# Altium project iiot_chip.PrjPcb
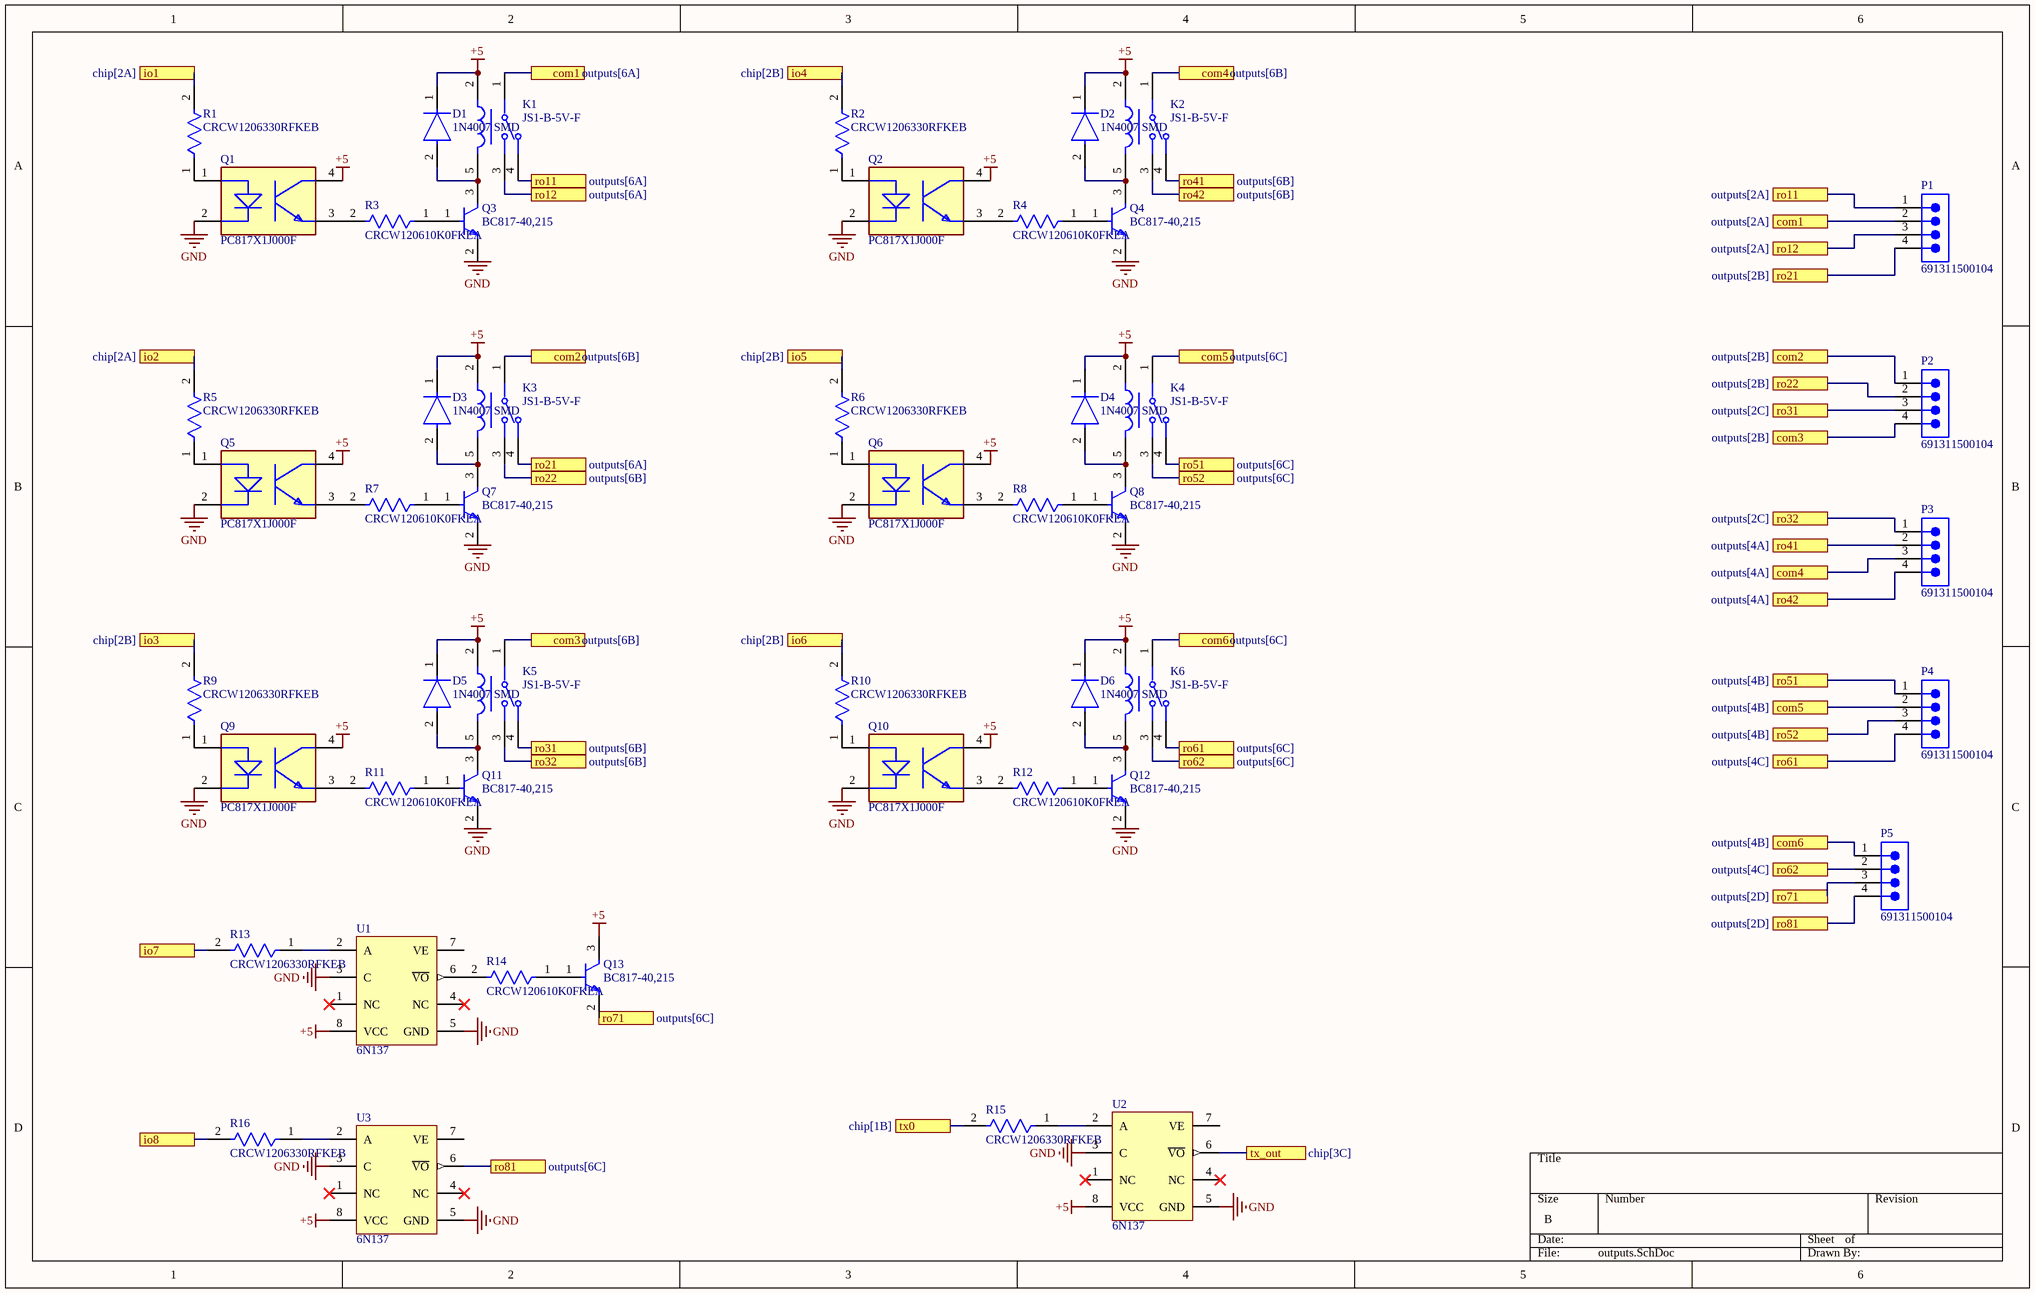
[diagram p0: outputs.SchDoc]
3 sheets, 95 parts. Net scope: flat (ports and power ports of the same name join across sheets).
Board file: iiot_with_chip.PcbDoc
Sheets:
  outputs.SchDoc
  inputs.SchDoc
  chip.SchDoc

## Sheet outputs.SchDoc
size B; SheetNumber: 1; SheetTotal: 3

### Parts
D1  1N4007 SMD  [FP-1N4007_SMD-IPC_C]
D2  1N4007 SMD  [FP-1N4007_SMD-IPC_C]
D3  1N4007 SMD  [FP-1N4007_SMD-IPC_C]
D4  1N4007 SMD  [FP-1N4007_SMD-IPC_C]
D5  1N4007 SMD  [FP-1N4007_SMD-IPC_C]
D6  1N4007 SMD  [FP-1N4007_SMD-IPC_C]
K1  JS1-B-5V-F  [FP-JS1-B-5V-F-MFG]
K2  JS1-B-5V-F  [FP-JS1-B-5V-F-MFG]
K3  JS1-B-5V-F  [FP-JS1-B-5V-F-MFG]
K4  JS1-B-5V-F  [FP-JS1-B-5V-F-MFG]
K5  JS1-B-5V-F  [FP-JS1-B-5V-F-MFG]
K6  JS1-B-5V-F  [FP-JS1-B-5V-F-MFG]
P1  691311500104  [691311500104]
P2  691311500104  [691311500104]
P3  691311500104  [691311500104]
P4  691311500104  [691311500104]
P5  691311500104  [691311500104]
Q1  PC817X1J000F  [FP-PC817X1J000F-MFG]
Q2  PC817X1J000F  [FP-PC817X1J000F-MFG]
Q3  BC817-40,215  [FP-SOT23-MFG]
Q4  BC817-40,215  [FP-SOT23-MFG]
Q5  PC817X1J000F  [FP-PC817X1J000F-MFG]
Q6  PC817X1J000F  [FP-PC817X1J000F-MFG]
Q7  BC817-40,215  [FP-SOT23-MFG]
Q8  BC817-40,215  [FP-SOT23-MFG]
Q9  PC817X1J000F  [FP-PC817X1J000F-MFG]
Q10  PC817X1J000F  [FP-PC817X1J000F-MFG]
Q11  BC817-40,215  [FP-SOT23-MFG]
Q12  BC817-40,215  [FP-SOT23-MFG]
Q13  BC817-40,215  [FP-SOT23-MFG]
R1  CRCW1206330RFKEB  [FP-CRCW1206-e3-IPC_A]
R2  CRCW1206330RFKEB  [FP-CRCW1206-e3-IPC_A]
R3  CRCW120610K0FKEA  [FP-CRCW1206-e3-IPC_C]
R4  CRCW120610K0FKEA  [FP-CRCW1206-e3-IPC_C]
R5  CRCW1206330RFKEB  [FP-CRCW1206-e3-IPC_A]
R6  CRCW1206330RFKEB  [FP-CRCW1206-e3-IPC_A]
R7  CRCW120610K0FKEA  [FP-CRCW1206-e3-IPC_C]
R8  CRCW120610K0FKEA  [FP-CRCW1206-e3-IPC_C]
R9  CRCW1206330RFKEB  [FP-CRCW1206-e3-IPC_A]
R10  CRCW1206330RFKEB  [FP-CRCW1206-e3-IPC_A]
R11  CRCW120610K0FKEA  [FP-CRCW1206-e3-IPC_C]
R12  CRCW120610K0FKEA  [FP-CRCW1206-e3-IPC_C]
R13  CRCW1206330RFKEB  [FP-CRCW1206-e3-IPC_A]
R14  CRCW120610K0FKEA  [FP-CRCW1206-e3-IPC_C]
R15  CRCW1206330RFKEB  [FP-CRCW1206-e3-IPC_A]
R16  CRCW1206330RFKEB  [FP-CRCW1206-e3-IPC_A]
U1  6N137  [VISH-DIP-8_A]
U2  6N137  [VISH-DIP-8_A]
U3  6N137  [VISH-DIP-8_A]

### Ports
com1 (see outputs[2A]), com1 (see outputs[6A]), com2 (see outputs[2B]), com2 (see outputs[6B]), com3 (see outputs[2B]), com3 (see outputs[6B]), com4 (see outputs[4A]), com4 (see outputs[6B]), com5 (see outputs[4B]), com5 (see outputs[6C]), com6 (see outputs[4B]), com6 (see outputs[6C]), io1 (see chip[2A]), io2 (see chip[2A]), io3 (see chip[2B]), io4 (see chip[2B]), io5 (see chip[2B]), io6 (see chip[2B]), io7, io8, ro11 (see outputs[2A]), ro11 (see outputs[6A]), ro12 (see outputs[2A]), ro12 (see outputs[6A]), ro21 (see outputs[2B]), ro21 (see outputs[6A]), ro22 (see outputs[2B]), ro22 (see outputs[6B]), ro31 (see outputs[2C]), ro31 (see outputs[6B]), ro32 (see outputs[2C]), ro32 (see outputs[6B]), ro41 (see outputs[4A]), ro41 (see outputs[6B]), ro42 (see outputs[4A]), ro42 (see outputs[6B]), ro51 (see outputs[4B]), ro51 (see outputs[6C]), ro52 (see outputs[4B]), ro52 (see outputs[6C]), ro61 (see outputs[4C]), ro61 (see outputs[6C]), ro62 (see outputs[4C]), ro62 (see outputs[6C]), ro71 (see outputs[2D]), ro71 (see outputs[6C]), ro81 (see outputs[2D]), ro81 (see outputs[6C]), tx0 (see chip[1B]), tx_out (see chip[3C])

### Nets
+5: D1.1(C) D2.1(C) D3.1(C) D4.1(C) D5.1(C) D6.1(C) K1.2 K2.2 K3.2 K4.2 K5.2 K6.2 Q1.4(C) Q2.4(C) Q5.4(C) Q6.4(C) Q9.4(C) Q10.4(C) Q13.3(C) U1.8(VCC) U2.8(VCC) U3.8(VCC)
GND: Q1.2(C) Q2.2(C) Q3.2(E) Q4.2(E) Q5.2(C) Q6.2(C) Q7.2(E) Q8.2(E) Q9.2(C) Q10.2(C) Q11.2(E) Q12.2(E) U1.3(C) U1.5(GND) U2.3(C) U2.5(GND) U3.3(C) U3.5(GND)
NetD1_2: D1.2(A) K1.5 Q3.3(C)
NetD2_2: D2.2(A) K2.5 Q4.3(C)
NetD3_2: D3.2(A) K3.5 Q7.3(C)
NetD4_2: D4.2(A) K4.5 Q8.3(C)
NetD5_2: D5.2(A) K5.5 Q11.3(C)
NetD6_2: D6.2(A) K6.5 Q12.3(C)
NetK1_1: K1.1(COM) P1.2 ; port com1
NetK1_3: K1.3(NO) P1.3 ; port ro12
NetK1_4: K1.4(NC) P1.1 ; port ro11
NetK2_1: K2.1(COM) P3.3 ; port com4
NetK2_3: K2.3(NO) P3.4 ; port ro42
NetK2_4: K2.4(NC) P3.2 ; port ro41
NetK3_1: K3.1(COM) P2.1 ; port com2
NetK3_3: K3.3(NO) P2.2 ; port ro22
NetK3_4: K3.4(NC) P1.4 ; port ro21
NetK4_1: K4.1(COM) P4.2 ; port com5
NetK4_3: K4.3(NO) P4.3 ; port ro52
NetK4_4: K4.4(NC) P4.1 ; port ro51
NetK5_1: K5.1(COM) P2.4 ; port com3
NetK5_3: K5.3(NO) P3.1 ; port ro32
NetK5_4: K5.4(NC) P2.3 ; port ro31
NetK6_1: K6.1(COM) P5.1 ; port com6
NetK6_3: K6.3(NO) P5.2 ; port ro62
NetK6_4: K6.4(NC) P4.4 ; port ro61
NetMD1_26: R1.2 ; port io1
NetMD1_27: R9.2 ; port io3
NetMD1_28: R2.2 ; port io4
NetMD1_29: R5.2 ; port io2
NetMD1_30: R6.2 ; port io5
NetMD1_31: R10.2 ; port io6
NetMD1_35: R15.2 ; port tx0
NetP5_3: P5.3 Q13.2(E) ; port ro71
NetP5_4: P5.4 U3.6(~{VO}) ; port ro81
NetP8_3: U2.6(~{VO}) ; port tx_out
NetQ1_1: Q1.1(A) R1.1
NetQ1_3: Q1.3(E) R3.2
NetQ2_1: Q2.1(A) R2.1
NetQ2_3: Q2.3(E) R4.2
NetQ3_1: Q3.1(B) R3.1
NetQ4_1: Q4.1(B) R4.1
NetQ5_1: Q5.1(A) R5.1
NetQ5_3: Q5.3(E) R7.2
NetQ6_1: Q6.1(A) R6.1
NetQ6_3: Q6.3(E) R8.2
NetQ7_1: Q7.1(B) R7.1
NetQ8_1: Q8.1(B) R8.1
NetQ9_1: Q9.1(A) R9.1
NetQ9_3: Q9.3(E) R11.2
NetQ10_1: Q10.1(A) R10.1
NetQ10_3: Q10.3(E) R12.2
NetQ11_1: Q11.1(B) R11.1
NetQ12_1: Q12.1(B) R12.1
NetQ13_1: Q13.1(B) R14.1
NetR13_1: R13.1 U1.2(A)
NetR13_2: R13.2 ; port io7
NetR14_2: R14.2 U1.6(~{VO})
NetR15_1: R15.1 U2.2(A)
NetR16_1: R16.1 U3.2(A)
NetR16_2: R16.2 ; port io8

Not connected (* = marked no-connect by the designer): U1 1(NC)* 4(NC)* 7(VE); U2 1(NC)* 4(NC)* 7(VE); U3 1(NC)* 4(NC)* 7(VE)

### Library data of the parts
D1-D6 = CMP-12389-000001-1: Rectifier, 1Kv, 1A, Do-214Ac Rohs Compliant: Yes
K1-K6 = CMP-00287-00689748-1: JS1-B-5V-F Electromechanical Relay 5VDC 69.4Ohm 5ADC/10AAC SPDT (22x16x16.4)mm THT Power Relay; NexarPartId: 689748; Coil Voltage (DC): 5V; Coil Resistance: 69.4Ω; Coil Power: 360mW; Voltage Rating (AC): 250V; Number of Contacts: 1; Coil Type: Non-Latching; Current Rating: 10A; Coil Current: 72mA; Operate Time: 10ms; Max Voltage Rating (DC): 100V; Relay Type: General Purpose; Throw Configuration: SPDT; Depth: 16mm; Lead Free: Lead Free; Contact Material: Silver, Tin; Max Operating Temperature: 85°C; Number of Pins: 5; Mount: Through Hole; Ambient Temperature Range High: 85°C; Height: 16mm; Weight: 12g; Power Consumption: 360mW; REACH SVHC: No SVHC; Min Operating Temperature: -40°C; Termination: PC Pin; Width: 22mm; Max Current Rating: 10A; Packaging: Bulk; Length: 22mm; Switching Current: 10A; Power Rating: 360mW; RoHS: Compliant; Max Voltage Rating (AC): 250V; Release Time: 10ms; Contact Current Rating: 10A
P1-P5 = CMP-1502-02148-2: NexarPartId: 8917749; Pitch: 5.08mm; Number of Positions Per Level: 4; Gender: Male; Voltage: 300V; Current: 20A; Number of Levels: 1; Orientation: Vertical; Number of Pins: 4; Mount: Through Hole; Number of Contacts: 4; Length: 8.5mm; Number of Rows: 1; Contact Plating: Tin; Color: Green; Termination: Solder; Contact Material: Brass; REACH SVHC: Unknown; RoHS: Compliant; Lead Pitch: 5.08mm; Width: 22.32mm; Height: 12mm; Packaging: Box
Q1 Q2 Q5 Q6 Q9 Q10 = CMP-65434-000003-1: OPTOISOLATOR 5KV TRANS 4DIP; Collector Emitter Saturation Voltage: 200mV; Forward Voltage: 1.4V; Power Dissipation: 200mW; Input Current: 20mA; Max Collector Current: 50mA; Collector Emitter Breakdown Voltage: 80V; Rise Time: 18000ns; Number of Elements: 1; Reverse Breakdown Voltage: 6V; Current Transfer Ratio: 600%; Min Operating Temperature: -30°C; Number of Pins: 4; Radiation Hardening: No; Output Current per Channel: 50mA; Case/Package: DIP; Fall Time: 18000ns; Forward Current: 50mA; Isolation Voltage: 5kV; Package Quantity: 2000; Max Operating Temperature: 100°C; Packaging: Sleeve; Max Input Current: 50mA; Output Voltage: 80V; Max Power Dissipation: 200mW; Mount: Through Hole; Number of Channels: 1; Collector Emitter Voltage (VCEO): 80V
Q3 Q4 Q7 Q8 Q11-Q13 = CMP-14406-000007-1: TRANS NPN 45V 0.5A SOT23; Manufacturer: Nexperia; Collector Emitter Saturation Voltage: 700mV; Power Dissipation: 250mW; Collector Base Voltage: 50V; Unity Gain Freq: 100MHz; Hfe Max: 600; Rthja Max: 500K/W; Emitter Base Voltage: 5V; Max Collector Current: 500mA; Hfe Testvce: 1V; Automotive Grade: Grade 0; Hfe Min: 250; Max Junction Temp: +150°C; Number Of Npn: 1; Hfe Testic: 100mA; Octopart: https://octopart.com/bc817-40%2C215-nexperia-78739081; Lead Free: Yes; Ipc Land Pattern Name: SOT95P230X100-3; Manufacturer Part Number: BC817-40,215; RoHS: TRUE; Collector Emitter Breakdown Voltage: 45V; Digikey Description: TRANS NPN 45V 0.5A SOT23; ComponentLink2URL: https://assets.nexperia.com/documents/data-sheet/BC817_SER.pdf; Temperature Range High: +150°C; Mouser Description: BC817 Series 45 V 500 mA 250 mW SMT NPN General-Purpose Transistor - SOT-23-; Device Class L3: BJTs; Temperature: to +150°C; Height: 1.1mm; Automotive: Yes; Ambient Temperature Range Low: -65°C; Package: SOT23; Collector Emitter Voltage: 45V; Category: Trans; ComponentLink2Description: Datasheet; Device Class L2: Transistors; Ambient Temperature Range High: +150°C; Number Of Elements: 1; Device Class L1: Discrete Semiconductors; Footprint Url: https://assets.nexperia.com/documents/outline-drawing/SOT23.pdf
R1 R2 R5 R6 R9 R10 R13 R15 R16 = CMP-02407-010853-1: RES Thick Film, 330Ω, 1%, 0.25W, 100ppm/°C, 1206; Resistance: 330R; Power Rating: 250mW; Voltage Rating: 200V; Package Quantity: 10000; Width: 0.063inch; Length: 0.126inch; Case/Package: 1206; Lead Free: Lead Free; Max Operating Temperature: 155°C; Height: 0.024inch; Case Code (Imperial): 1206; Weight: 0.000353oz; Max Power Dissipation: 250mW; Packaging: Tape and Reel; Case Code (Metric): 3216; Number of Terminations: 2; Min Operating Temperature: -55°C; Features: Automotive AEC-Q200; Tolerance: 1%; Composition: Thick Film; Temperature Coefficient: 100ppm/°C
R3 R4 R7 R8 R11 R12 R14 = CMP-2003-04807-2: RES Thick Film, 10kΩ, 1%, 0.25W, 100ppm/°C, 1206; Working Voltage: 200V; Max Power Dissipation: 250mW; Resistance: 10kR; Tolerance: 1%; Width: 0.063inch; Height: 0.55mm; Number of Pins: 2; Voltage Rating: 200V; Temperature Coefficient: 100ppm/°C; Military Standard: Not; Features: Automotive AEC-Q200; Depth: 1.6mm; Radiation Hardening: No; Termination: SMD/SMT; Case Code (Imperial): 1206; Weight: 0.000353oz; Length: 3.2mm; Package Quantity: 10; Voltage Rating (DC): 200V; Case/Package: 1206; Min Operating Temperature: -55°C; Number of Terminations: 2; Composition: Thick Film; Contact Plating: Tin; Power Rating: 250mW; Packaging: Tape and Reel; Max Operating Temperature: 155°C; Lead Free: Lead Free; Case Code (Metric): 3216
U1-U3 = CMP-2000-05669-1: High Speed Optocoupler, Single and Dual, 10 MBd, 5 V, -40 to 100 degC, 8-Pin DIP, RoHS, Tube; Manufacturer: Vishay; No. of Channels: 1Channel; Isolation Voltage: 5.3kV; Data Rate: 10Mbaud; SVHC: ToBeAdvised; No. of Pins: 8Pins; Package Description: 8-Pin Double In-line Package, Body 10.16 x 6.7 mm, Pitch 2.54 mm; Manufacturer URL: http://www.vishay.com/; Product Range: -; Optocoupler Case Style: DIP; Mounting Technology: ThroughHole; Packaging: Each; Package Reference: DIP-8; Datasheet Version: Rev. 1.9, 03/2015; Datasheet URL: http://www.vishay.com/docs/84732/6n137.pdf

## Sheet inputs.SchDoc
size B; SheetNumber: 2; SheetTotal: 3
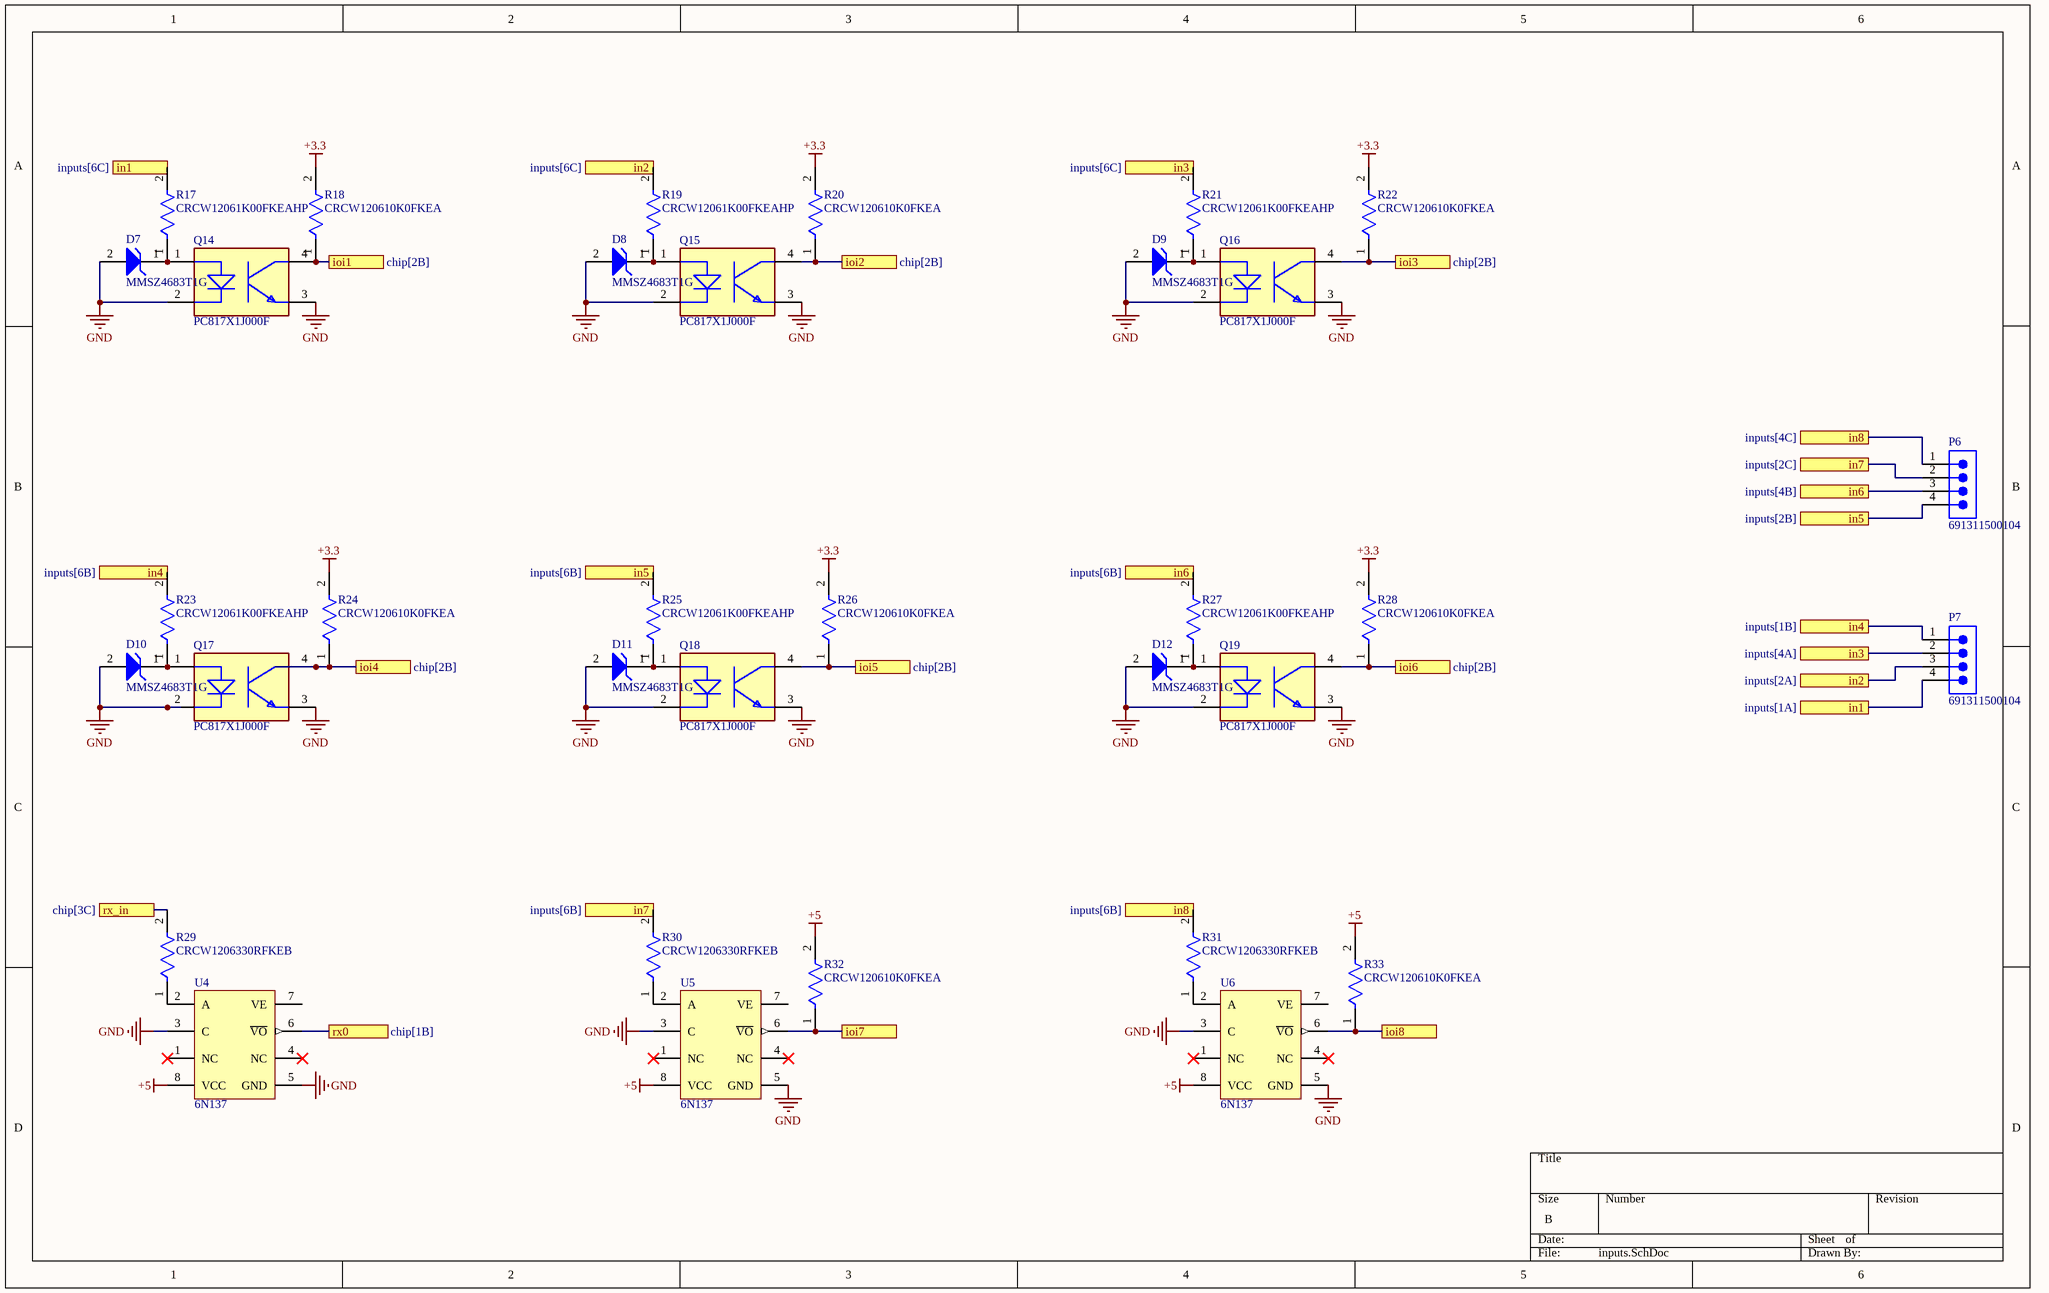
[diagram p1: inputs.SchDoc]

### Parts
D7  MMSZ4683T1G  [ONSC-SOD-123-2-425-04_V]
D8  MMSZ4683T1G  [ONSC-SOD-123-2-425-04_V]
D9  MMSZ4683T1G  [ONSC-SOD-123-2-425-04_V]
D10  MMSZ4683T1G  [ONSC-SOD-123-2-425-04_V]
D11  MMSZ4683T1G  [ONSC-SOD-123-2-425-04_V]
D12  MMSZ4683T1G  [ONSC-SOD-123-2-425-04_V]
P6  691311500104  [691311500104]
P7  691311500104  [691311500104]
Q14  PC817X1J000F  [FP-PC817X1J000F-MFG]
Q15  PC817X1J000F  [FP-PC817X1J000F-MFG]
Q16  PC817X1J000F  [FP-PC817X1J000F-MFG]
Q17  PC817X1J000F  [FP-PC817X1J000F-MFG]
Q18  PC817X1J000F  [FP-PC817X1J000F-MFG]
Q19  PC817X1J000F  [FP-PC817X1J000F-MFG]
R17  CRCW12061K00FKEAHP  [FP-CRCW1206-HPe3-MFG]
R18  CRCW120610K0FKEA  [FP-CRCW1206-e3-IPC_C]
R19  CRCW12061K00FKEAHP  [FP-CRCW1206-HPe3-MFG]
R20  CRCW120610K0FKEA  [FP-CRCW1206-e3-IPC_C]
R21  CRCW12061K00FKEAHP  [FP-CRCW1206-HPe3-MFG]
R22  CRCW120610K0FKEA  [FP-CRCW1206-e3-IPC_C]
R23  CRCW12061K00FKEAHP  [FP-CRCW1206-HPe3-MFG]
R24  CRCW120610K0FKEA  [FP-CRCW1206-e3-IPC_C]
R25  CRCW12061K00FKEAHP  [FP-CRCW1206-HPe3-MFG]
R26  CRCW120610K0FKEA  [FP-CRCW1206-e3-IPC_C]
R27  CRCW12061K00FKEAHP  [FP-CRCW1206-HPe3-MFG]
R28  CRCW120610K0FKEA  [FP-CRCW1206-e3-IPC_C]
R29  CRCW1206330RFKEB  [FP-CRCW1206-e3-IPC_A]
R30  CRCW1206330RFKEB  [FP-CRCW1206-e3-IPC_A]
R31  CRCW1206330RFKEB  [FP-CRCW1206-e3-IPC_A]
R32  CRCW120610K0FKEA  [FP-CRCW1206-e3-IPC_C]
R33  CRCW120610K0FKEA  [FP-CRCW1206-e3-IPC_C]
U4  6N137  [VISH-DIP-8_A]
U5  6N137  [VISH-DIP-8_A]
U6  6N137  [VISH-DIP-8_A]

### Ports
in1 (see inputs[1A]), in1 (see inputs[6C]), in2 (see inputs[2A]), in2 (see inputs[6C]), in3 (see inputs[4A]), in3 (see inputs[6C]), in4 (see inputs[1B]), in4 (see inputs[6B]), in5 (see inputs[2B]), in5 (see inputs[6B]), in6 (see inputs[4B]), in6 (see inputs[6B]), in7 (see inputs[2C]), in7 (see inputs[6B]), in8 (see inputs[4C]), in8 (see inputs[6B]), ioi1 (see chip[2B]), ioi2 (see chip[2B]), ioi3 (see chip[2B]), ioi4 (see chip[2B]), ioi5 (see chip[2B]), ioi6 (see chip[2B]), ioi7, ioi8, rx0 (see chip[1B]), rx_in (see chip[3C])

### Nets
+3.3: R18.2 R20.2 R22.2 R24.2 R26.2 R28.2
+5: R32.2 R33.2 U4.8(VCC) U5.8(VCC) U6.8(VCC)
GND: D7.2(A) D8.2(A) D9.2(A) D10.2(A) D11.2(A) D12.2(A) Q14.2(C) Q14.3(E) Q15.2(C) Q15.3(E) Q16.2(C) Q16.3(E) Q17.2(C) Q17.3(E) Q18.2(C) Q18.3(E) Q19.2(C) Q19.3(E) U4.3(C) U4.5(GND) U5.3(C) U5.5(GND) U6.3(C) U6.5(GND)
NetD7_1: D7.1(K) Q14.1(A) R17.1
NetD8_1: D8.1(K) Q15.1(A) R19.1
NetD9_1: D9.1(K) Q16.1(A) R21.1
NetD10_1: D10.1(K) Q17.1(A) R23.1
NetD11_1: D11.1(K) Q18.1(A) R25.1
NetD12_1: D12.1(K) Q19.1(A) R27.1
NetMD1_6: Q15.4(C) R20.1 ; port ioi2
NetMD1_7: Q14.4(C) R18.1 ; port ioi1
NetMD1_8: Q17.4(C) R24.1 ; port ioi4
NetMD1_9: Q16.4(C) R22.1 ; port ioi3
NetMD1_11: Q19.4(C) R28.1 ; port ioi6
NetMD1_12: Q18.4(C) R26.1 ; port ioi5
NetMD1_34: U4.6(~{VO}) ; port rx0
NetP6_1: P6.1 R31.2 ; port in8
NetP6_2: P6.2 R30.2 ; port in7
NetP6_3: P6.3 R27.2 ; port in6
NetP6_4: P6.4 R25.2 ; port in5
NetP7_1: P7.1 R23.2 ; port in4
NetP7_2: P7.2 R21.2 ; port in3
NetP7_3: P7.3 R19.2 ; port in2
NetP7_4: P7.4 R17.2 ; port in1
NetP8_4: R29.2 ; port rx_in
NetR29_1: R29.1 U4.2(A)
NetR30_1: R30.1 U5.2(A)
NetR31_1: R31.1 U6.2(A)
NetR32_1: R32.1 U5.6(~{VO}) ; port ioi7
NetR33_1: R33.1 U6.6(~{VO}) ; port ioi8

Not connected (* = marked no-connect by the designer): U4 1(NC)* 4(NC)* 7(VE); U5 1(NC)* 4(NC)* 7(VE); U6 1(NC)* 4(NC)* 7(VE)

### Library data of the parts
D7-D12 = CMP-1060-00600-1: Zener Voltage Regulator, 500 mW, 2-Pin SOD-123, Pb-Free, Tape and Reel; Manufacturer: On Semiconductor; P Max (W): 0.5; VZ Typ (V): 3; ComponentLink2Description: Datasheet; ComponentLink3URL: http://www.onsemi.com/pub_link/Collateral/425-04.PDF; PackageVersion: Rev. G, 10/2009; RoHS: Pb-Free; ComponentLink2URL: http://www.onsemi.com/pub_link/Collateral/MMSZ4678T1-D.PDF; DatasheetVersion: Rev. 9; PackageDescription: 2-Pin SOD, Body 1.6 x 2.69 mm; PartNumber: MMSZ4683T1G; ComponentLink3Description: Package Specification; ComponentLink1URL: http://www.onsemi.com/; ComponentLink1Description: Manufacturer URL; Packing: Tape and Reel; PackageReference: SOD-123-2-425-04; Mounting Technology: Surface Mount
P6 P7 = CMP-1502-02148-2: as P1 on sheet outputs; Orientation: Vertical; Number of Pins: 4; Mount: Through Hole; Number of Contacts: 4; Length: 8.5mm; Number of Rows: 1; Contact Plating: Tin; Color: Green; Termination: Solder; Contact Material: Brass; REACH SVHC: Unknown; RoHS: Compliant; Lead Pitch: 5.08mm; Width: 22.32mm; Height: 12mm; Packaging: Box
Q14-Q19 = CMP-65434-000003-1: as Q1 on sheet outputs; Min Operating Temperature: -30°C; Number of Pins: 4; Radiation Hardening: No; Output Current per Channel: 50mA; Case/Package: DIP; Fall Time: 18000ns; Forward Current: 50mA; Isolation Voltage: 5kV; Package Quantity: 2000; Max Operating Temperature: 100°C; Packaging: Sleeve; Max Input Current: 50mA; Output Voltage: 80V; Max Power Dissipation: 200mW; Mount: Through Hole; Number of Channels: 1; Collector Emitter Voltage (VCEO): 80V
R17 R19 R21 R23 R25 R27 = CMP-2003-04874-2: RES SMD 1K OHM 1% 3/4W 1206; Manufacturer: Vishay; Automotive Grade: Grade 0; Resistance: 1kΩ; Power Rating: 0.75W; Temperature Coefficient: 100ppm/°C; Value: 1kΩ; Voltage Rating: 200V; Category: Res; Tolerance: 1%; Manufacturer Part Number: CRCW12061K00FKEAHP; Mouser Description: Res Thick Film 1206 1K Ohm 1% 0.75W ±100ppm/°C Molded SMD SMD Paper T/R; Octopart: https://octopart.com/crcw12061k00fkeahp-vishay-42635114; Package: CRCW1206-HPe3; Device Class L1: Passive Components; Ipc Land Pattern Name: RESC310160X50; Temperature Range High: +155°C; Lead Free: Yes; Device Class L2: Resistors; RoHS: TRUE; Temperature: -55°C to +155°C; Composition: Thick Film; Height: 0.65mm; Automotive: Yes; ComponentLink2Description: Datasheet; Digikey Description: RES SMD 1K OHM 1% 3/4W 1206; ComponentLink2URL: http://www.vishay.com/docs/20043/crcwhpe3.pdf; Device Class L3: Chip SMD Resistors; Series: CRCW-HP e3; Temperature Range Low: -55°C
R18 R20 R22 R24 R26 R28 R32 R33 = CMP-2003-04807-2: as R3 on sheet outputs; Tolerance: 1%; Width: 0.063inch; Height: 0.55mm; Number of Pins: 2; Voltage Rating: 200V; Temperature Coefficient: 100ppm/°C; Military Standard: Not; Features: Automotive AEC-Q200; Depth: 1.6mm; Radiation Hardening: No; Termination: SMD/SMT; Case Code (Imperial): 1206; Weight: 0.000353oz; Length: 3.2mm; Package Quantity: 10; Voltage Rating (DC): 200V; Case/Package: 1206; Min Operating Temperature: -55°C; Number of Terminations: 2; Composition: Thick Film; Contact Plating: Tin; Power Rating: 250mW; Packaging: Tape and Reel; Max Operating Temperature: 155°C; Lead Free: Lead Free; Case Code (Metric): 3216
R29-R31 = CMP-02407-010853-1: as R1 on sheet outputs; Package Quantity: 10000; Width: 0.063inch; Length: 0.126inch; Case/Package: 1206; Lead Free: Lead Free; Max Operating Temperature: 155°C; Height: 0.024inch; Case Code (Imperial): 1206; Weight: 0.000353oz; Max Power Dissipation: 250mW; Packaging: Tape and Reel; Case Code (Metric): 3216; Number of Terminations: 2; Min Operating Temperature: -55°C; Features: Automotive AEC-Q200; Tolerance: 1%; Composition: Thick Film; Temperature Coefficient: 100ppm/°C
U4-U6 = CMP-2000-05669-1: as U1 on sheet outputs; Package Description: 8-Pin Double In-line Package, Body 10.16 x 6.7 mm, Pitch 2.54 mm; Manufacturer URL: http://www.vishay.com/; Product Range: -; Optocoupler Case Style: DIP; Mounting Technology: ThroughHole; Packaging: Each; Package Reference: DIP-8; Datasheet Version: Rev. 1.9, 03/2015; Datasheet URL: http://www.vishay.com/docs/84732/6n137.pdf

## Sheet chip.SchDoc
size A; SheetNumber: 3; SheetTotal: 3
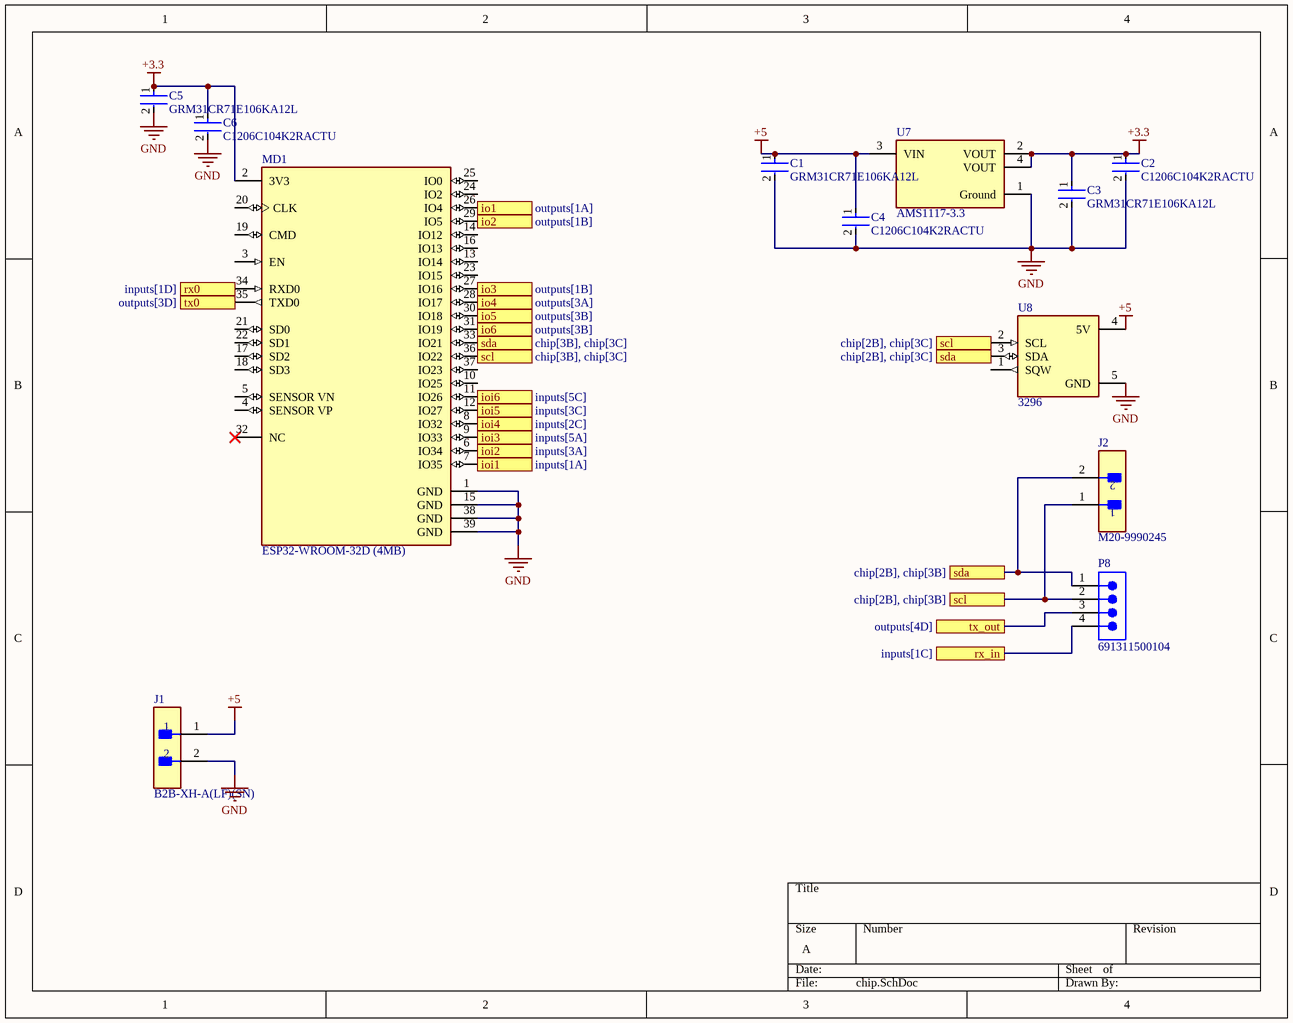
[diagram p2: chip.SchDoc]

### Parts
C1  GRM31CR71E106KA12L  [FP-GRM31C-0_2-e0_3_0_8-MFG]
C2  C1206C104K2RACTU  [FP-C1206C-EB-MFG]
C3  GRM31CR71E106KA12L  [FP-GRM31C-0_2-e0_3_0_8-MFG]
C4  C1206C104K2RACTU  [FP-C1206C-EB-MFG]
C5  GRM31CR71E106KA12L  [FP-GRM31C-0_2-e0_3_0_8-MFG]
C6  C1206C104K2RACTU  [FP-C1206C-EB-MFG]
J1  B2B-XH-A(LF)(SN)  [FP-B2B-XH-A_LF_SN-MFG]
J2  M20-9990245  [FP-M20-9990245-MFG]
MD1  ESP32-WROOM-32D (4MB)  [FP-ESP32-WROOM-32D_4MB-MFG]
P8  691311500104  [691311500104]
U7  AMS1117-3.3  [FP-AMS1117-IPC_C]
U8  3296  [MODULE_3296]

### Ports
io1 (see outputs[1A]), io2 (see outputs[1B]), io3 (see outputs[1B]), io4 (see outputs[3A]), io5 (see outputs[3B]), io6 (see outputs[3B]), ioi1 (see inputs[1A]), ioi2 (see inputs[3A]), ioi3 (see inputs[5A]), ioi4 (see inputs[2C]), ioi5 (see inputs[3C]), ioi6 (see inputs[5C]), rx0 (see inputs[1D]), rx_in (see inputs[1C]), scl (see chip[2B], chip[3B]), scl (see chip[2B], chip[3C]), scl (see chip[3B], chip[3C]), sda (see chip[2B], chip[3B]), sda (see chip[2B], chip[3C]), sda (see chip[3B], chip[3C]), tx0 (see outputs[3D]), tx_out (see outputs[4D])

### Nets
+3.3: C2.1 C3.1 C5.1 C6.1 MD1.2(3V3) U7.2(VOUT) U7.4(VOUT)
+5: C1.1 C4.1 J1.1 U7.3(VIN) U8.4(5V)
GND: C1.2 C2.2 C3.2 C4.2 C5.2 C6.2 J1.2 MD1.1(GND) MD1.15(GND) MD1.38(GND) MD1.39(GND) U7.1(Ground) U8.5(GND)
NetJ2_1: J2.1 MD1.36(IO22) P8.2 U8.2(SCL) ; port scl
NetJ2_2: J2.2 MD1.33(IO21) P8.1 U8.3(SDA) ; port sda
NetMD1_6: MD1.6(IO34) ; port ioi2
NetMD1_7: MD1.7(IO35) ; port ioi1
NetMD1_8: MD1.8(IO32) ; port ioi4
NetMD1_9: MD1.9(IO33) ; port ioi3
NetMD1_11: MD1.11(IO26) ; port ioi6
NetMD1_12: MD1.12(IO27) ; port ioi5
NetMD1_26: MD1.26(IO4) ; port io1
NetMD1_27: MD1.27(IO16) ; port io3
NetMD1_28: MD1.28(IO17) ; port io4
NetMD1_29: MD1.29(IO5) ; port io2
NetMD1_30: MD1.30(IO18) ; port io5
NetMD1_31: MD1.31(IO19) ; port io6
NetMD1_34: MD1.34(RXD0) ; port rx0
NetMD1_35: MD1.35(TXD0) ; port tx0
NetP8_3: P8.3 ; port tx_out
NetP8_4: P8.4 ; port rx_in

Not connected (* = marked no-connect by the designer): MD1 3(EN) 4(SENSOR_VP) 5(SENSOR_VN) 10(IO25) 13(IO14) 14(IO12) 16(IO13) 17(SD2) 18(SD3) 19(CMD) 20(CLK) 21(SD0) 22(SD1) 23(IO15) 24(IO2) 25(IO0) 32(NC)* 37(IO23); U8 1(SQW)

### Library data of the parts
C1 C3 C5 = CMP-06035-003589-1: Chip Multilayer Ceramic Capacitors for General Purpose, 1206, 10uF, X7R, 15%, 10%, 25V; Case Code (Imperial): 1206; Voltage Rating (DC): 25V; Voltage Rating: 25V; Length: 3.2mm; Lead Free: Lead Free; Thickness: 0.071inch; Package Quantity: 1; Width: 1.6mm; Max Operating Temperature: 125°C; Number of Pins: 2; Height: 1.6mm; Case Code (Metric): 3216; REACH SVHC: No SVHC; Radiation Hardening: No; Case/Package: 1206; Material: Ceramic; Tolerance: 10%; Voltage: 25V; Mount: Surface Mount; Packaging: Tape and Reel; Dielectric: X7R; Termination: SMD/SMT; Min Operating Temperature: -55°C; Capacitance: 10uF; Depth: 1.6mm
C2 C4 C6 = CMP-1037-04222-2: CAP CER 0.1UF 200V 10% X7R 1206; Manufacturer: KEMET; Automotive Grade: Grade 0; Tolerance: 0.1; Value: 0.10 μF; Material: Ceramic; Temperature Coefficient: 15%; Description: C1206 0.10 μF X7R 10.00% 200 V; Automotive: Yes; Temperature Characteristic: X7R; Digikey Description: CAP CER 0.1UF 200V 10% X7R 1206; ComponentLink2URL: https://content.kemet.com/datasheets/KEM_C1007_X8R_ULTRA_150C_SMD.pdf; Voltage Rating: 200 V; Manufacturer Part Number: C1206C104K2RACTU; Temperature Range High: +150°C; Device Class L1: Passive Components; Octopart: https://octopart.com/c1206c104k2ractu-kemet-9138344; Temperature: -55°C to +150°C; Height: 0.88mm; Device Class L3: Ceramic Capacitors; Lead Free: Yes; Package: C1206C-EB; Category: Cap; Temperature Range Low: -55°C; Mouser Description: Multilayer Ceramic Capacitors MLCC - SMD/SMT 200volts 0.1uF X7R 10%; Ipc Land Pattern Name: CAPC320160X78; Capacitance: 0.10 μF; RoHS: TRUE; ComponentLink2Description: Datasheet; Device Class L2: Capacitors
J1 = CMP-2000-05888-3: CONN HEADER VERT 2POS 2.5MM; Current Rating: 3A; Voltage Rating: 250V; Number of Contacts: 2; Contact Resistance: 20mR; Wire/Cable Gauge: 22AWG; Insulation Resistance: 1GR; Connector Type: Male Pin; Packaging: Bulk; Contact Material: Brass; Lead Free: Lead Free; Orientation: Straight; Contact Plating: Tin; Max Current Rating: 3A; Termination: Solder; Fastening Type: Detent; Depth: 5.75mm; Housing Material: Polyamide; REACH SVHC: No SVHC; Series: XH; Voltage Rating (AC): 250V; Number of Positions: 2; Color: Natural; Contact Type: Male Pin; Max Voltage Rating (DC): 250V; Pitch: 2.5mm; Lead Pitch: 2.5mm; Mount: Through Hole; Max Operating Temperature: 85°C; Length: 7.4mm; Max Voltage Rating (AC): 250V; Min Operating Temperature: -25°C; Number of Rows: 1; Housing Color: White
J2 = CMP-15831-000105-1: CONN HEADER VERT 2POS 2.54MM; Working Voltage: 750V; Gender: Male; Number of Poles: 2; Current Rating: 3A; Mated Stacking Heights: 16.54mm; Contact Resistance: 25mR; Connector Type: Male Pin; Insulation Resistance: 10GR; Mating Cycles: 300; Voltage: 50V; Flammability Rating: UL94 V-0; Pitch: 2.54mm; Series: M20; Number of Contacts: 2; Height: 0.12inch; Min Operating Temperature: -40°C; Contact Finish - Mating: GOLD; Number of Positions: 2; Number of Rows: 1; Packaging: Bulk; Package Quantity: 1000; Voltage Rating (AC): 750V; Current: 3A; Mount: Through Hole; Case/Package: SIL; Orientation: Straight; Contact Shape: Square; Weight: 0.25lb; Radiation Hardening: No; Fastening Type: Pull; Length: 5.08mm; Depth: 2.54mm; Contact Mating Length: 0.24inch; Housing Material: Nylon; Reach SVHC Compliant: Yes; Insulation Material: Nylon; Color: Black; Width: 0.25inch; Insulation Color: Black; Contact Material: Brass; Contact Type: Male Pin; Termination: Solder; Max Operating Temperature: 105°C; Contact Plating: Gold; Housing Color: Black; Max Current Rating: 3A; Lead Pitch: 2.54mm
MD1 = CMP-194065-000009-1: RX TXRX MOD WIFI TRACE ANT SMD
P8 = CMP-1502-02148-2: as P1 on sheet outputs; Orientation: Vertical; Number of Pins: 4; Mount: Through Hole; Number of Contacts: 4; Length: 8.5mm; Number of Rows: 1; Contact Plating: Tin; Color: Green; Termination: Solder; Contact Material: Brass; REACH SVHC: Unknown; RoHS: Compliant; Lead Pitch: 5.08mm; Width: 22.32mm; Height: 12mm; Packaging: Box
U7 = CMP-209535-000001-1: LDO Voltage Regulators 1A, 3.3V; Manufacturer: Advanced Monolithic Systems; Dropout Voltage: 1.1V; Output Type: Fixed; Nominal Supply Current: 5mA; Max Power Dissipation: 1.2W; Max Supply Voltage: 15V; Number Of Outputs: 1; Standoff Height: 0.64mm; Max Junction Temp: +125°C; Height: 1.8mm; Package: AMS1117; Device Class L2: Power Management ICs; ComponentLink2Description: Datasheet; ComponentLink2URL: http://www.advanced-monolithic.com/pdf/ds1117.pdf; Category: IC; RoHS: TRUE; Automotive: No; Device Class L1: Integrated Circuits (ICs); Output Current: 1A; Device Class L3: Voltage Regulators - Linear; Temperature: -40°C to +125°C; Output Voltage: 3.3V; Manufacturer Part Number: AMS1117-3.3; Temperature Range Low: -40°C; Octopart: https://octopart.com/ams1117-3.3-advanced+monolithic+systems-25899300; Lead Free: Yes; Ipc Land Pattern Name: SOT229P700X180-4; Temperature Range High: +125°C
U8 = 3296: DS1307 Real Time Clock (RTC) Timing Evaluation Board; MF: Adafruit; Package: None; Price: None; Check_prices: https://www.snapeda.com/parts/3296/Adafruit+Industries/view-part/?ref=eda; Value: *; SnapEDA_Link: https://www.snapeda.com/parts/3296/Adafruit+Industries/view-part/?ref=snap; MP: 3296; Availability: In Stock; Purchase-URL: https://pricing.snapeda.com/search/part/3296/?ref=eda

## Nets that join several sheets
+3.3: inputs (6 pins), chip (7 pins)
+5: outputs (22 pins), inputs (5 pins), chip (5 pins)
GND: outputs (18 pins), inputs (24 pins), chip (13 pins)
NetMD1_6: inputs (Q15.4 R20.1), chip (MD1.6)
NetMD1_7: inputs (Q14.4 R18.1), chip (MD1.7)
NetMD1_8: inputs (Q17.4 R24.1), chip (MD1.8)
NetMD1_9: inputs (Q16.4 R22.1), chip (MD1.9)
NetMD1_11: inputs (Q19.4 R28.1), chip (MD1.11)
NetMD1_12: inputs (Q18.4 R26.1), chip (MD1.12)
NetMD1_26: outputs (R1.2), chip (MD1.26)
NetMD1_27: outputs (R9.2), chip (MD1.27)
NetMD1_28: outputs (R2.2), chip (MD1.28)
NetMD1_29: outputs (R5.2), chip (MD1.29)
NetMD1_30: outputs (R6.2), chip (MD1.30)
NetMD1_31: outputs (R10.2), chip (MD1.31)
NetMD1_34: inputs (U4.6), chip (MD1.34)
NetMD1_35: outputs (R15.2), chip (MD1.35)
NetP8_3: outputs (U2.6), chip (P8.3)
NetP8_4: inputs (R29.2), chip (P8.4)